# Altium project Amplifier.PrjPCB
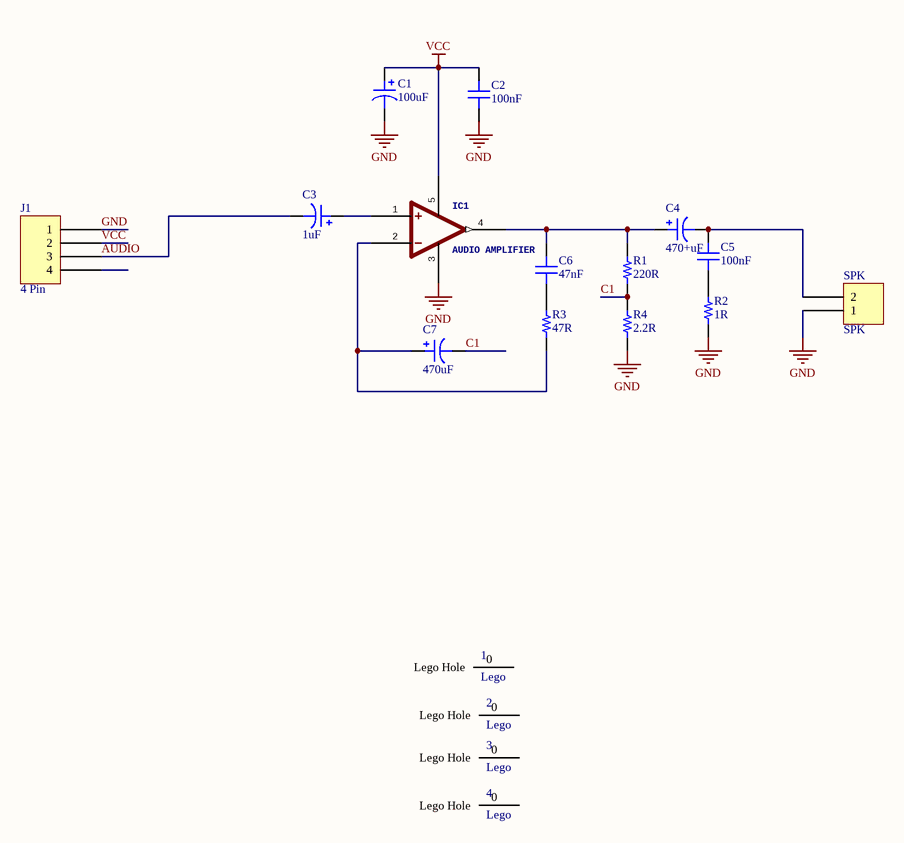
[diagram p0: Amplifier.SchDoc]
1 sheet, 18 parts. Net scope: global (net labels, ports and power ports of the same name join across sheets).
Board file: Amplifier.PcbDoc

## Sheet Amplifier.SchDoc
size A

### Parts
1  Lego  [Lego Hole]
2  Lego  [Lego Hole]
3  Lego  [Lego Hole]
4  Lego  [Lego Hole]
C1  100uF  [CAP ALUM 5MM]
C2  100nF  [CAP 1206/3216]
C3  1uF  [CAP ALUM 5MM]
C4  470+uF  [CAP ALUM 5MM]
C5  100nF  [CAP 1206/3216]
C6  47nF  [CAP 1206/3216]
C7  470uF  [CAP ALUM 5MM]
IC1  AUDIO AMPLIFIER  [TDA2003]
J1  4 Pin  [JST XH B4B-XH-A - RIGHT]
R1  220R  [RES 1206/3216]
R2  1R  [RES 1206/3216]
R3  47R  [RES 1206/3216]
R4  2.2R  [RES 1206/3216]
SPK  SPK  [Socket_Blue_2]

### Nets
GND: C1.2 C2.1 IC1.3(GND) J1.1 R2.1 R4.1 SPK.1
VCC: C1.1 C2.2 IC1.5(V+) J1.2
AUDIO: C3.2 J1.3
C1: C7.2 R1.1 R4.2
NetC3_1: C3.1 IC1.1(+IN)
NetC4_1: C4.1 C6.2 IC1.4(OUT) R1.2
NetC4_2: C4.2 C5.2 SPK.2
NetC5_1: C5.1 R2.2
NetC6_1: C6.1 R3.2
NetC7_1: C7.1 IC1.2(-IN) R3.1

Not connected (* = marked no-connect by the designer): 1 0(Lego_Hole); 2 0(Lego_Hole); 3 0(Lego_Hole); 4 0(Lego_Hole); J1 4

### Library data of the parts
C1 C3 C4 C7 = Polarised Capacitor: SMT Polarised Capacitor; Value: 10uF
C2 C5 C6 = Capacitor: SMT Capacitor; Value: 0.1uF
IC1 = TDA2003V: GateName_1: A; SymbolName_1: OPAMP+GN; DeviceName: V; MF: Vishay Semiconductor; LibraryName: TDA2003; DeviceSetName: TDA2003; Package: CB360; Package: Pentawatt-5 Vishay Semiconductor; Price: None; MP: TDA2003; Availability: Unavailable
R1-R4 = Resistor: SMT Resistor; Value: 1K
SPK = 2 Pin